# Altium schematic sheet Load_Switches.SchDoc
size A3; SheetNumber: 4; SheetTotal: 16
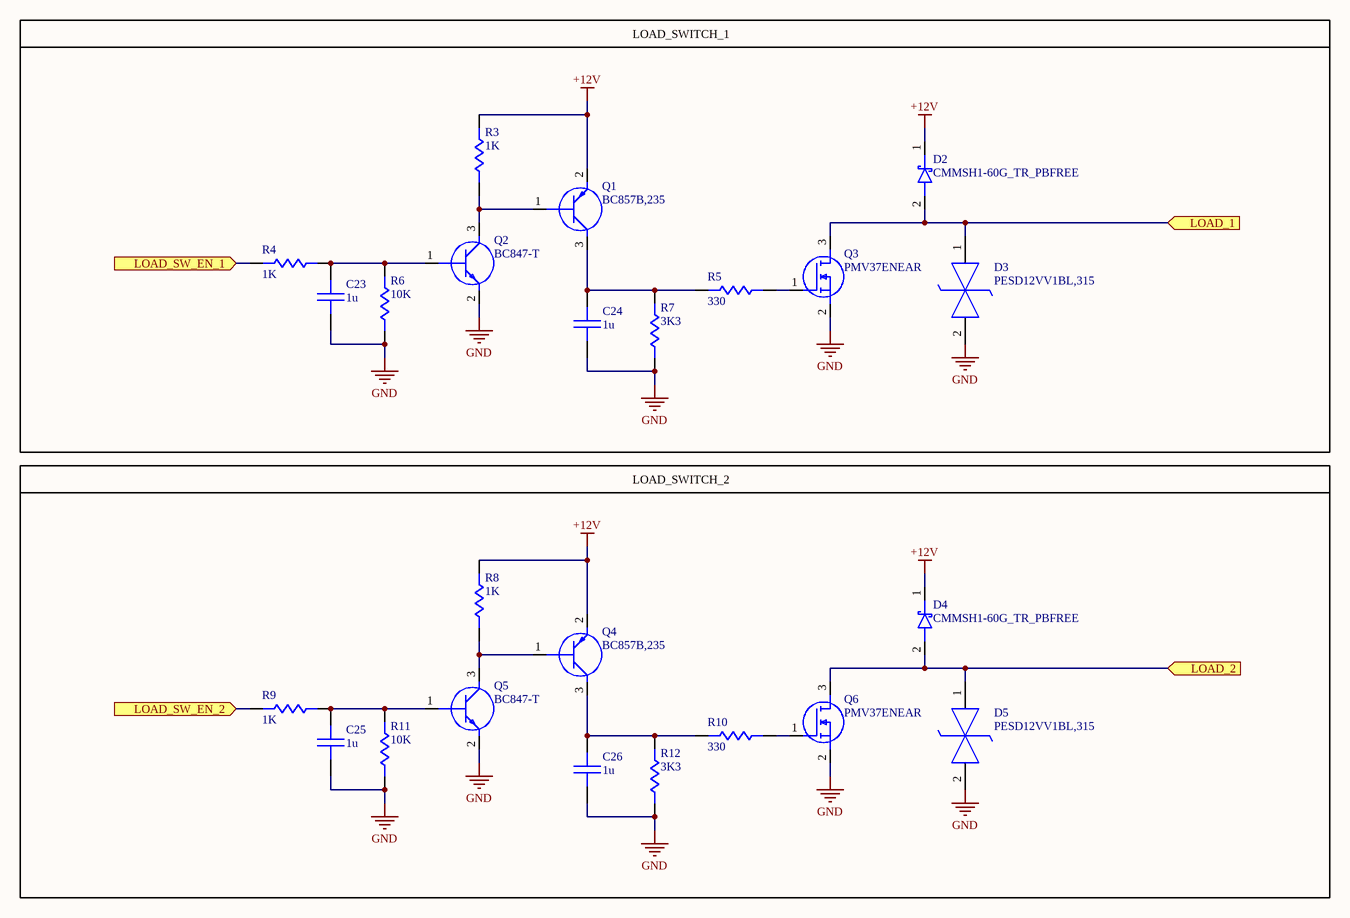
[diagram p0: Load_Switches.SchDoc]

## Parts
C23  1u  [C_0603]
C24  1u  [C_0603]
C25  1u  [C_0603]
C26  1u  [C_0603]
D2  CMMSH1-60G_TR_PBFREE  [SOD-123-2]
D3  PESD12VV1BL,315  [PESD5V0S1BL315]
D4  CMMSH1-60G_TR_PBFREE  [SOD-123-2]
D5  PESD12VV1BL,315  [PESD5V0S1BL315]
Q1  BC857B,235  [SOT95P230X110-3N]
Q2  BC847-T  [SOT95P240X115-3N]
Q3  PMV37ENEAR  [SOT95P230X110-3N]
Q4  BC857B,235  [SOT95P230X110-3N]
Q5  BC847-T  [SOT95P240X115-3N]
Q6  PMV37ENEAR  [SOT95P230X110-3N]
R3  1K  [R_0603]
R4  1K  [R_0603]
R5  330  [R_0603]
R6  10K  [R_0603]
R7  3K3  [R_0603]
R8  1K  [R_0603]
R9  1K  [R_0603]
R10  330  [R_0603]
R11  10K  [R_0603]
R12  3K3  [R_0603]

## Blocks framed on the sheet
LOAD_SWITCH_1: C23 C24 D2 D3 Q1-Q3 R3-R7
LOAD_SWITCH_2: C25 C26 D4 D5 Q4-Q6 R8-R12

## Ports
LOAD_1 (in, see Interconnections[2A], Main_Connector[1B]), LOAD_2 (in, see Interconnections[2A], Main_Connector[1B]), LOAD_SW_EN_1 (in, see Interconnections[3A], IO_Expander[3A]), LOAD_SW_EN_2 (in, see Interconnections[3A], IO_Expander[3A])

## Nets
+12V: D2.1(K) D4.1(K) Q1.2(E) Q4.2(E) R3.1 R8.1
GND: C23.2 C24.2 C25.2 C26.2 D3.2(K2) D5.2(K2) Q2.2(E) Q3.2(S) Q5.2(E) Q6.2(S) R6.2 R7.2 R11.2 R12.2
LOAD_1: D2.2(A) D3.1(K1) Q3.3(D) ; port LOAD_1
LOAD_2: D4.2(A) D5.1(K1) Q6.3(D) ; port LOAD_2
LOAD_SW_EN_1: R4.1 ; port LOAD_SW_EN_1
LOAD_SW_EN_2: R9.1 ; port LOAD_SW_EN_2
NetC23_1: C23.1 Q2.1(B) R4.2 R6.1
NetC24_1: C24.1 Q1.3(C) R5.2 R7.1
NetC25_1: C25.1 Q5.1(B) R9.2 R11.1
NetC26_1: C26.1 Q4.3(C) R10.2 R12.1
NetQ1_1: Q1.1(B) Q2.3(C) R3.2
NetQ3_1: Q3.1(G) R5.1
NetQ4_1: Q4.1(B) Q5.3(C) R8.2
NetQ6_1: Q6.1(G) R10.1

## Library data of the parts
C23-C26 = CAP: SMD Chip Capacitor
D2 D4 = DIODE_SCHOTTKY_CMMSH1-60G_TR_PBFREE: Schottky Diodes & Rectifiers; Vrm: 60V; If: 1A; Vf: 0.85A; ComponentLink1Description: New link; ComponentLink1URL: https://www.mouser.com.tr/ProductDetail/Central-Semiconductor/CMMSH1-60G-TR-PBFREE?qs=u16ybLDytRaqwQ9Jtbd3vg%3D%3D
D3 D5 = PESD12VV1BL,315: Diode ESD (Bi-directional); Manufacturer_Name: Nexperia; Datasheet Link: https://assets.nexperia.com/documents/data-sheet/PESD12VV1BL.pdf; Height: 0mm; Manufacturer_Part_Number: PESD12VV1BL,315; Mouser Part Number: 771-PESD12VV1BL,315; Mouser Price/Stock: https://www.mouser.co.uk/ProductDetail/Nexperia/PESD12VV1BL315?qs=zHGtguZFFhIuyro4byE1mg%3D%3D; Arrow Part Number: PESD12VV1BL,315; Arrow Price/Stock: https://www.arrow.com/en/products/pesd12vv1bl315/nexperia?region=nac
Q1 Q4 = BC857B,235: Transistor BJT PNP; Manufacturer_Name: Nexperia; Datasheet Link: https://assets.nexperia.com/documents/data-sheet/BC856_BC857_BC858.pdf; Height: 1.1mm; Manufacturer_Part_Number: BC857B,235; Mouser Part Number: 771-BC857B235; Mouser Price/Stock: https://www.mouser.co.uk/ProductDetail/Nexperia/BC857B235?qs=me8TqzrmIYWSnmooO7Bp2g%3D%3D; Arrow Part Number: BC857B,235; Arrow Price/Stock: https://www.arrow.com/en/products/bc857b235/nexperia?region=europe
Q2 Q5 = BC847-T: Transistor BJT NPN; Manufacturer_Name: Rectron; Datasheet Link: https://www.rectron.com/public/product_datasheets/bc846-bc848.pdf; Height: 1.15mm; Manufacturer_Part_Number: BC847-T; Mouser Part Number: 583-BC847; Mouser Price/Stock: https://www.mouser.co.uk/ProductDetail/Rectron/BC847-T?qs=88VD4TDCwKCxjiqyDdAfrw%3D%3D
Q3 Q6 = PMV37ENEAR: MOSFET (N-Channel); Manufacturer_Name: Nexperia; Datasheet Link: https://assets.nexperia.com/documents/data-sheet/PMV37ENEA.pdf; Height: 1.1mm; Manufacturer_Part_Number: PMV37ENEAR; Mouser Part Number: 771-PMV37ENEAR; Mouser Price/Stock: https://www.mouser.co.uk/ProductDetail/Nexperia/PMV37ENEAR?qs=T3oQrply3y%2Frl%252BtsBfD26A%3D%3D; Arrow Part Number: PMV37ENEAR; Arrow Price/Stock: https://www.arrow.com/en/products/pmv37enear/nexperia?region=nac
R3-R12 = RES: SMD Chip Resistor